# EAGLE design RailroadShield (EAGLE 7.7.0)
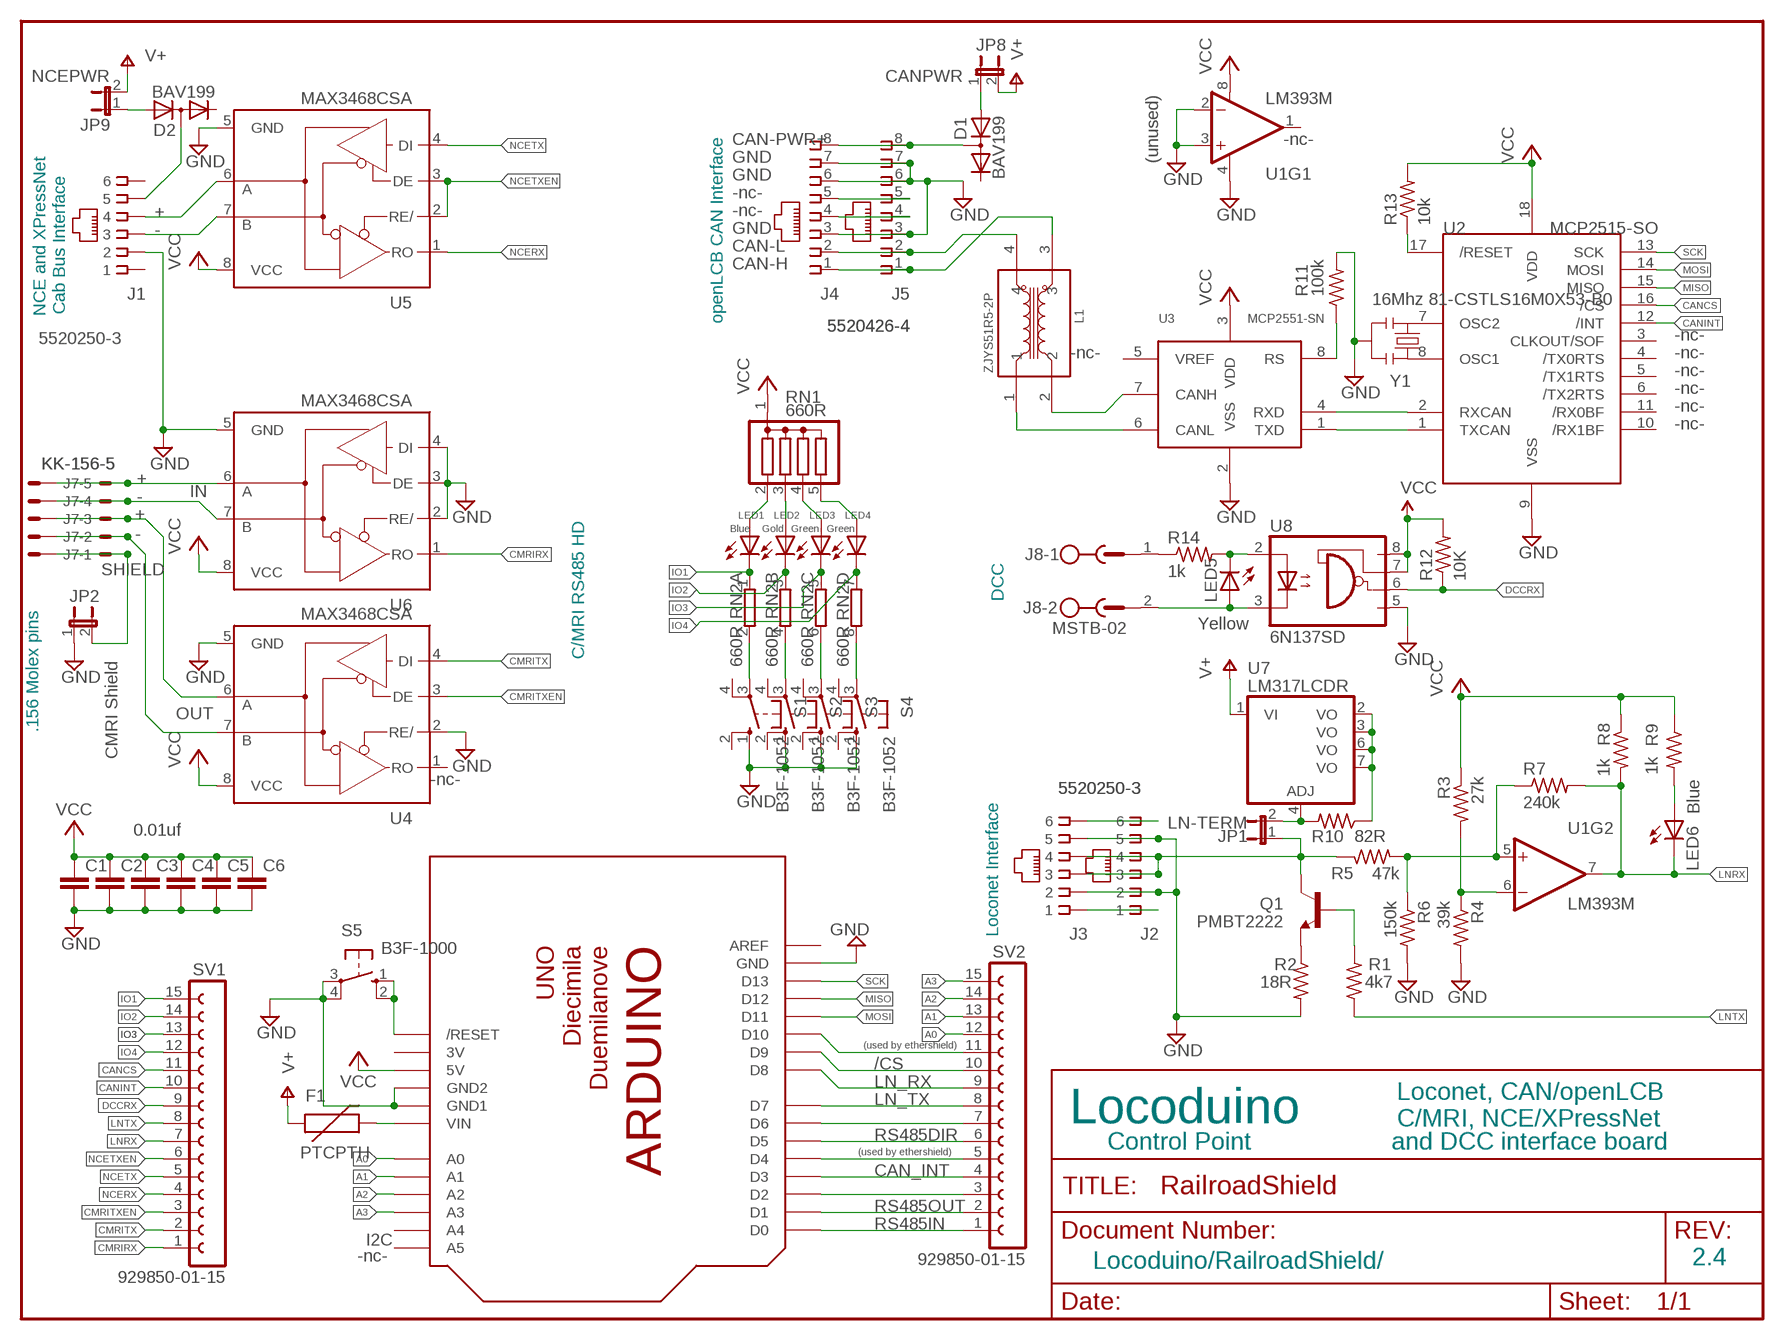
[diagram p0: schematic, sheet 1]

## Parts
C1  0.01uf  CAP0805  [0805]
C2  0.01uf  CAP0805  [0805]
C3  0.01uf  CAP0805  [0805]
C4  0.01uf  CAP0805  [0805]
C5  0.01uf  CAP0805  [0805]
C6  0.01uf  CAP0805  [0805]
D1  BAV199  [SOT23]
D2  BAV199  [SOT23]
F1  PTCPTH  [PTC]
J1  5520250-3  RJ11-6XRA  [RJ11-NO_SHIELD]
J2  5520250-3  RJ11-6XRA  [RJ11-NO_SHIELD]
J3  5520250-3  RJ11-6XRA  [RJ11-NO_SHIELD]
J4  5520426-4  RJ45-8X  [RJ45-NO-SHIELD]
J5  5520426-4  RJ45-8X  [RJ45-NO-SHIELD]
J6  KK-156-5  [KK-156-5]
J7  KK-156-5  [KK-156-5]
J8  MSTB-02  MSTBV2  [MSTBV2]
JP1  LN-TERM  JUMPER-2PTH_LOCK  [1X02_LOCK]
JP2  CMRI Shield  JUMPER-2PTH_LOCK  [1X02_LOCK]
JP8  CANPWR  JUMPER-2PTH_LOCK  [1X02_LOCK]
JP9  NCEPWR  JUMPER-2PTH_LOCK  [1X02_LOCK]
L1  ZJYS51R5-2P  [ZJYS]
LED1  Blue  LEDCHIP-LED0805  [CHIP-LED0805]
LED2  Gold  LEDCHIP-LED0805  [CHIP-LED0805]
LED3  Green  LEDCHIP-LED0805  [CHIP-LED0805]
LED4  Green  LEDCHIP-LED0805  [CHIP-LED0805]
LED5  Yellow  LEDCHIP-LED0805  [CHIP-LED0805]
LED6  Blue  LEDCHIP-LED0805  [CHIP-LED0805]
Q1  PMBT2222  TRANSISTOR_NPNSOT23-3  [SOT23-3]
R1  4k7  R-US_R0805  [R0805]
R2  18R  R-US_R0805  [R0805]
R3  27k  R-US_R0805  [R0805]
R4  39k  R-US_R0805  [R0805]
R5  47k  R-US_R0805  [R0805]
R6  150k  R-US_R0805  [R0805]
R7  240k  R-US_R0805  [R0805]
R8  1k  R-US_R0805  [R0805]
R9  1k  R-US_R0805  [R0805]
R10  82R  R-US_R0805  [R0805]
R11  100k  R-US_R0805  [R0805]
R12  10K  R-US_R0805  [R0805]
R13  10k  R-US_R0805  [R0805]
R14  1k  R-US_R0805  [R0805]
RN1  660R  G04R  [SIL5]
RN2  660R  E4R  [SIL8]
S1  B3F-1052  10-XX  [B3F-10XX]
S2  B3F-1052  10-XX  [B3F-10XX]
S3  B3F-1052  10-XX  [B3F-10XX]
S4  B3F-1052  10-XX  [B3F-10XX]
S5  B3F-1000  10-XX  [B3F-10XX]
SV1  929850-01-15  FE15-1  [FE15]
SV2  929850-01-15  FE15-1  [FE15]
U1  LM393M  [SO08]
U2  MCP2515-SO  [SO-18W]
U3  MCP2551-SN  [SO-08]
U4  MAX3468CSA  [SO08]
U5  MAX3468CSA  [SO08]
U6  MAX3468CSA  [SO08]
U7  LM317LCDR  LM317LD  [SO08]
U8  6N137SD  6N137S  [SM8]
U$1  ARDUINODUEMILANOVE  [ARDUINO-BIGSHIELD]
Y1  16Mhz 81-CSTLS16M0X53-B0  RESONATORPTH  [RESONATOR-PTH]

## Nets
/RESET: R13.1 U2.17(/RESET)
A0: SV2.12 U$1.A0
A1: SV2.13 U$1.A1
A2: SV2.14 U$1.A2
A3: SV2.15 U$1.A3
A/RESET: S5.1(S) S5.2(S1) U$1.RESET(/RESET)
CAN-H [Power]: J4.1 J5.1 L1.3
CAN-L [Power]: J4.2 J5.2 L1.4
CAN-PWR+ [Power]: D1.3(AC) J4.8 J5.8
CANCS: SV1.11 U2.16(/CS)
CANH [Power]: L1.2 U3.7(CANH)
CANINT: SV1.10 U2.12(/INT)
CANL [Power]: L1.1 U3.6(CANL)
CMRIRX: SV1.1 U6.1(RO)
CMRITX: SV1.2 U4.4(DI)
CMRITXEN: SV1.3 U4.3(DE)
D0: SV2.1 U$1.D0
D1: SV2.2 U$1.D1
D2: SV2.3 U$1.D2
D3: SV2.4 U$1.D3
D4: SV2.5 U$1.D4
D5: SV2.6 U$1.D5
D6: SV2.7 U$1.D6
D7: SV2.8 U$1.D7
D8: SV2.9 U$1.D8
D9: SV2.10 U$1.D9
D10: SV2.11 U$1.D10
DCC-A [Power]: LED5.C R14.2 U8.2(A)
DCCB [Power]: J8.2 LED5.A U8.3(C)
DCCRX: R12.1 SV1.9 U8.6(VO)
GND [Power]: C1.2 C2.2 C3.2 C4.2 C5.2 C6.2 J1.2 J2.2 J2.5 J3.2 J3.5 J4.3 J4.6 J4.7 J5.3 J5.6 J5.7 JP2.1 R2.2 R4.2 R6.2 R11.2 S1.1(S) S2.1(S) S3.1(S) S4.1(S) S5.3(P) S5.4(P1) U1.2(-IN) U1.3(+IN) U1.4(V-) U2.9(VSS) U3.2(VSS) U4.2(RE/) U4.5(GND) U5.5(GND) U6.2(RE/) U6.3(DE) U6.4(DI) U6.5(GND) U8.5(GND) U$1.GND U$1.GND1 U$1.GND2 Y1.2
IO1: LED1.C RN2.1 SV1.15
IO2: LED2.C RN2.3 SV1.14
IO3: LED3.C RN2.5 SV1.13
IO4: LED4.C RN2.7 SV1.12
L6+: LED6.A R9.2
LN-TX [Power]: Q1.1(B) R1.2
LNRX: LED6.C R7.2 R8.2 SV1.7 U1.7(OUT)
LNTX: R1.1 SV1.8
LOCONET [Power]: J2.3 J2.4 J3.3 J3.4 JP1.1 Q1.3(C) R5.1
LOCONET-IN: R5.2 R6.1 R7.1 U1.5(+IN)
MISO: U2.15(MISO) U$1.D12
MOSI: U2.14(MOSI) U$1.D11
N$1 [Power]: Q1.2(E) R2.1
N$2: LED1.A RN1.2
N$3: LED2.A RN1.3
N$4: LED3.A RN1.4
N$5: LED4.A RN1.5
N$6 [Power]: J6.1 J7.1 JP2.2
N$7: J6.2 J7.2 U4.7(B)
N$8: J6.3 J7.3 U4.6(A)
N$9: J6.4 J7.4 U6.7(B)
N$10: J6.5 J7.5 U6.6(A)
N$11 [Power]: J8.1 R14.1
N$12: U2.8(OSC1) Y1.3
N$13: U2.7(OSC2) Y1.1
N$14 [Power]: D2.1(A) JP9.1
N$15 [Power]: D1.1(A) JP8.1
N$16: RN2.2 S1.3(P)
N$17: RN2.4 S2.3(P)
N$18: RN2.6 S3.3(P)
N$19: RN2.8 S4.3(P)
N$20 [Power]: JP1.2 R10.2 U7.4(ADJ)
N$21 [Power]: F1.P$2 U$1.VIN
N-A: J1.4 U5.6(A)
N-B: J1.3 U5.7(B)
NCE-PWR+ [Power]: D2.3(AC) J1.5
NCERX: SV1.4 U5.1(RO)
NCETX: SV1.5 U5.4(DI)
NCETXEN: SV1.6 U5.2(RE/) U5.3(DE)
O-RESA [Power]: J4.4 J5.4
O-RESB [Power]: J4.5 J5.5
RAILSYNCA [Power]: J2.6 J3.6
RAILSYNCB [Power]: J2.1 J3.1
RS: R11.1 U3.8(RS)
RXCAN: U2.2(RXCAN) U3.4(RXD)
SCK: U2.13(SCK) U$1.D13
TXCAN: U2.1(TXCAN) U3.1(TXD)
V+ [Power]: F1.P$1 JP8.2 JP9.2 U7.1(VI)
V-LNREF: R3.2 R4.1 U1.6(-IN)
VCC [Power]: C1.1 C2.1 C3.1 C4.1 C5.1 C6.1 R3.1 R8.1 R9.1 R12.2 R13.2 RN1.1 U1.8(V+) U2.18(VDD) U3.3(VDD) U4.8(VCC) U5.8(VCC) U6.8(VCC) U8.7(VE) U8.8(VCC) U$1.5V
VOUT [Power]: R10.1 U7.2(VO) U7.3(VO) U7.6(VO) U7.7(VO)
Unconnected: D1.2(C) D2.2(C) J1.1 J1.6 S1.2(S1) S1.4(P1) S2.2(S1) S2.4(P1) S3.2(S1) S3.4(P1) S4.2(S1) S4.4(P1) U1.1(OUT) U2.3(CLKOUT/SOF) U2.4(/TX0RTS) U2.5(/TX1RTS) U2.6(/TX2RTS) U2.10(/RX1BF) U2.11(/RX0BF) U3.5(VREF) U4.1(RO) U$1.A4 U$1.A5 U$1.AREF

## Notes on the sheet
- -nc-
- (unused)
- -nc-
- + | -nc-
- -
- NCE and XPressNet | Cab Bus Interface
- openLCB CAN Interface
- -nc-
- -nc- | -nc-
- -nc-
- -nc-
- -nc-
- -nc-
- +
- IN
- -
- +
- -
- DCC
- SHIELD
- C/MRI RS485 HD
- OUT
- .156 Molex pins
- -nc-
- Loconet Interface
- (used by ethershield)
- /CS
- LN_RX
- Loconet, CAN/openLCB
- LN_TX
- Locoduino | C/MRI, NCE/XPressNet
- RS485DIR
- Control Point | and DCC interface board
- (used by ethershield)
- CAN_INT
- RS485OUT
- I2C | RS485IN
- -nc- | 2.4
- Locoduino/RailroadShield/

## Power pins joined to a net without a drawn wire
3V: U$1.3V

## Library data of the parts
C1-C6 = MCP:CAP: Capacitor Standard 0603 ceramic capacitor, and 0.1" leaded capacitor.
D1 D2 = diode:BAV199: DIODE low-leakage double diode
F1 = SparkFun:PTC: Resettable Fuse PTC Resettable Fuse. Spark Fun Electronics SKU : COM-08357
J1-J3 = MCP:RJ11: CORCOM Modular RJ Jacks No Shield Source: www.tycoelectronics.com .. ENG_DS_1654001_1099_RJ_L_0507.pdf
J4 J5 = MCP:RJ45: CORCOM Modular RJ Jacks No Shield Source: www.tycoelectronics.com .. ENG_DS_1654001_1099_RJ_L_0507.pdf
J6 J7 = MCP:KK-156-5: KK 156 HEADER Source: http://www.molex.com/pdm_docs/sd/026604100_sd.pdf
J8 = MCP:MSTBV2: PHOENIX
JP1 JP2 JP8 JP9 = MCP:JUMPER-2: Jumper Basic 0.1" spaced jumper. Use with breakaway headers.
L1 = MCP:ZJYS51R5: TDK ZJYS51R5-2P Common Mode Filter
LED1-LED6 = MCP:LED: LED OSRAM: - CHIPLED LG R971, LG N971, LY N971, LG Q971, LY Q971, LO R971, LY R971 LH N974, LH R974 LS Q976, LO Q976, LY Q976 LO Q996 - Hyper CHIPLED LW Q18S LB Q993, LB Q99A, LB R99A - SideLED LS A670, LO A670, LY A670, LG A670, LP A670 LB A673, LV A673, LT A673, LW A673 LH A674 LY A675 LS A676, LA A676, LO A676, LY A676, LW A676 LS A679, LY A679, LG A679 - Hyper Micro SIDELED® LS Y876, LA Y876, LO Y876, LY Y876 LT Y87S - SmartLED LW L88C, LW L88S LB L89C, LB L89S, LG L890 LS L89K, LO L89K, LY L89K LS L896, LA L896, LO L896, LY L896 - TOPLED LS T670, LO T670, LY T670, LG T670, LP T670 LSG T670, LSP T670, LSY T670, LOP T670, LYG T670 LG T671, LOG T671, LSG T671 LB T673, LV T673, LT T673, LW T673 LH T674 LS T676, LA T676, LO T676, LY T676, LB T676, LH T676, LSB T676, LW T676 LB T67C, LV T67C, LT T67C, LS T67K, LO T67K, LY T67K, LW E67C LS E67B, LA E67B, LO E67B, LY E67B, LB E67C, LV E67C, LT E67C LW T67C LS T679, LY T679, LG T679 LS T770, LO T770, LY T770, LG T770, LP T770 LB T773, LV T773, LT T773, LW T773 LH T774 LS E675, LA E675, LY E675, LS T675 LS T776, LA T776, LO T776, LY T776, LB T776 LHGB T686 LT T68C, LB T68C - Hyper Mini TOPLED® LB M676 - Mini TOPLED Santana® LG M470 LS M47K, LO M47K, LY M47K Source: http://www.osram.convergy.de LUXEON: - LUMILED® LXK2-PW12-R00, LXK2-PW12-S00, LXK2-PW14-U00, LXK2-PW14-V00 LXK2-PM12-R00, LXK2-PM12-S00, LXK2-PM14-U00 LXK2-PE12-Q00, LXK2-PE12-R00, LXK2-PE12-S00, LXK2-PE14-T00, LXK2-PE14-U00 LXK2-PB12-K00, LXK2-PB12-L00, LXK2-PB12-M00, LXK2-PB14-N00, LXK2-PB14-P00, LXK2-PB14-Q00 LXK2-PR12-L00, LXK2-PR12-M00, LXK2-PR14-Q00, LXK2-PR14-R00 LXK2-PD12-Q00, LXK2-PD12-R00, LXK2-PD12-S00 LXK2-PH12-R00, LXK2-PH12-S00 LXK2-PL12-P00, LXK2-PL12-Q00, LXK2-PL12-R00 Source: www.luxeon.com KINGBRIGHT: KA-3528ASYC Source: www.kingbright.com
Q1 = MCP:TRANSISTOR_NPN: Transistor NPN BJT configuration in SOT23 package. MMBT2222 is the common NPN we use. Double check BCE configuration again layout.
R1-R14 = rcl:R-US_: RESISTOR, American symbol
RN1 = resistor-sil:G04R: SIL RESISTOR; OC_FARNELL: unknown; OC_NEWARK: unknown
RN2 = resistor-sil:E4R: SIL RESISTOR; OC_FARNELL: unknown; OC_NEWARK: unknown
S1-S5 = MCP:10-XX: OMRON SWITCH
SV1 SV2 = con-lsta:FE15-1: FEMALE HEADER; OC_FARNELL: unknown; OC_NEWARK: unknown
U1 = MCP:LM393
U2 = MCP:MCP2515: Microchip MCP2515 Stand-Alone CAN Controller With SPI Interface Microchip Technology?s MCP2515 is a stand-alone Controller Area Network (CAN) controller that implements the CAN specification, version 2.0B. It is capable of transmitting and receiving both standard and extended data and remote frames. The MCP2515 has two acceptance masks and six acceptance filters that are used to filter out unwanted messages, thereby reducing the host MCUs overhead. The MCP2515 interfaces with microcontrollers (MCUs) via an industry standard Serial Peripheral Interface (SPI).
U3 = MCP:MCP2551: MCP2551 High-Speed CAN Transceiver
U4-U6 = MCP:MAX34*: +5V, Fail-Safe, 40Mbps, Profibus RS-485/RS-422 Transceivers Source: MAX3465-MAX3469.pdf
U7 = MCP:LM317LD: LOW CURRENT 1.2 TO 37V ADJUSTABLE VOLTAGE REGULATOR Source: http://pdf.alldatasheet.com
U8 = MCP:6N137: High Speed OPTO COUPLER Logic Gate output
U$1 = MCP:ARDUINO: Arduino Diecimila/Duemilanove Make a shield with ease, this package has all the named pins as well as the two mounting drill holes and an outline of the USB and DC power connector. The outline is on the DIMENSION layer, so if your board house uses it they will cut the outline to match. http://www.ladyada.net/library/pcb/eaglelibrary.html
Y1 = MCP:RESONATOR: Resonator Small SMD resonator. This is the itty bitty 10/20MHz resonators with built in caps. CSTCE10M0G55 and CSTCE20M0V53. Footprint has been reviewed closely but hasn't been tested yet.

## Net classes
1 Power: width 0.508 mm, clearance 0.254 mm

## Board
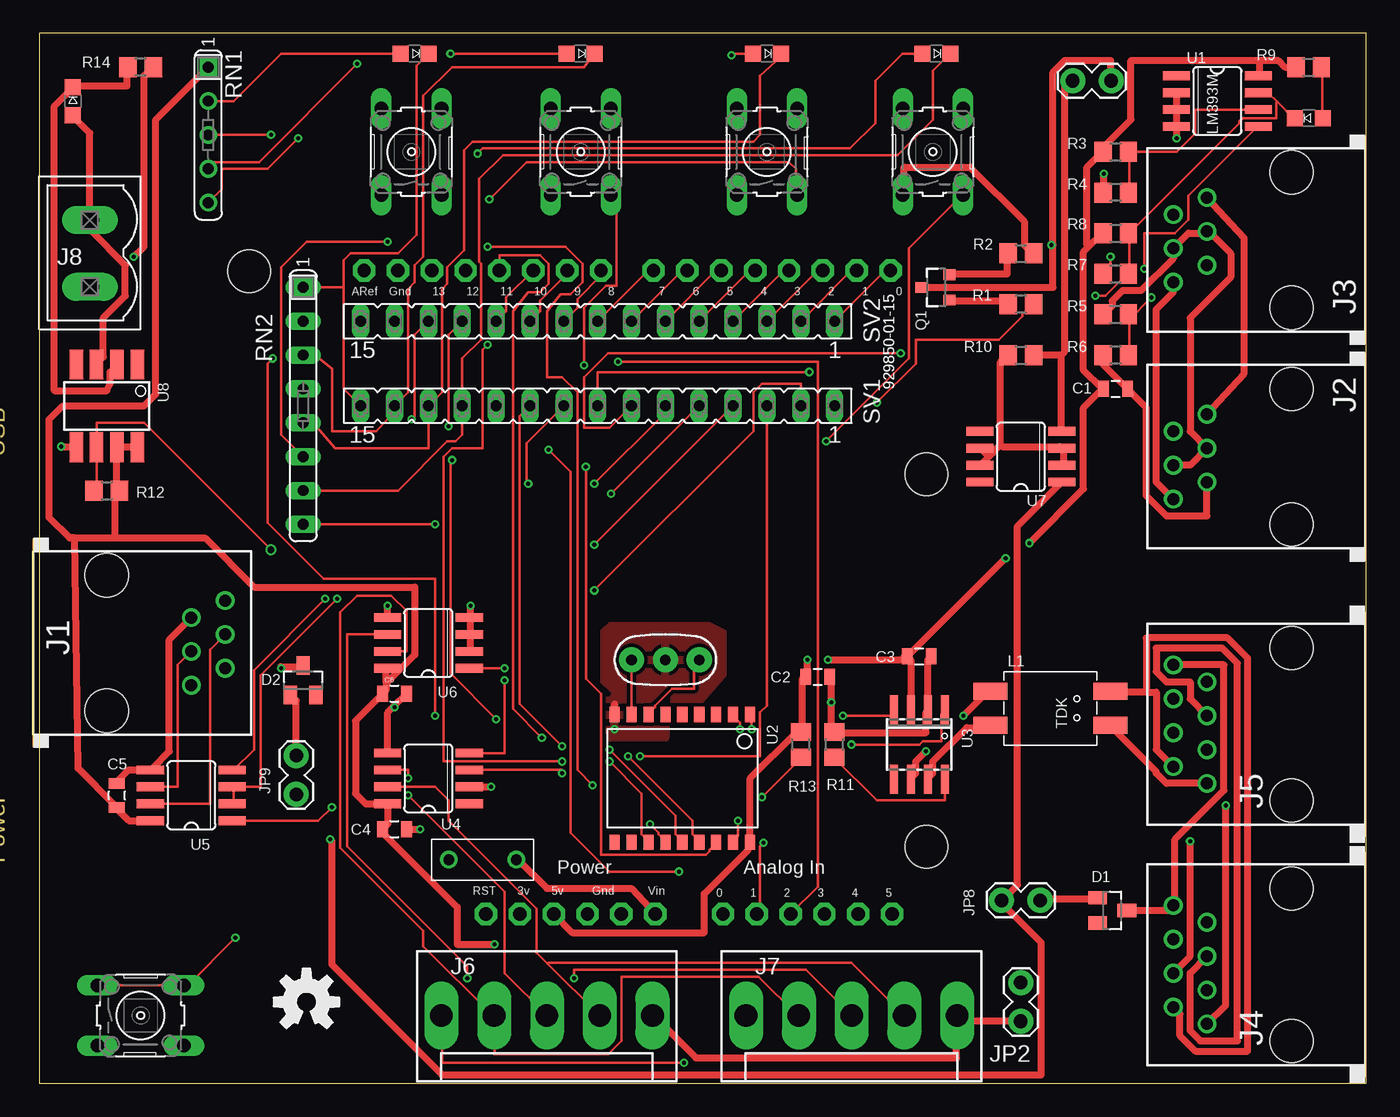
[diagram p1: board, top side]
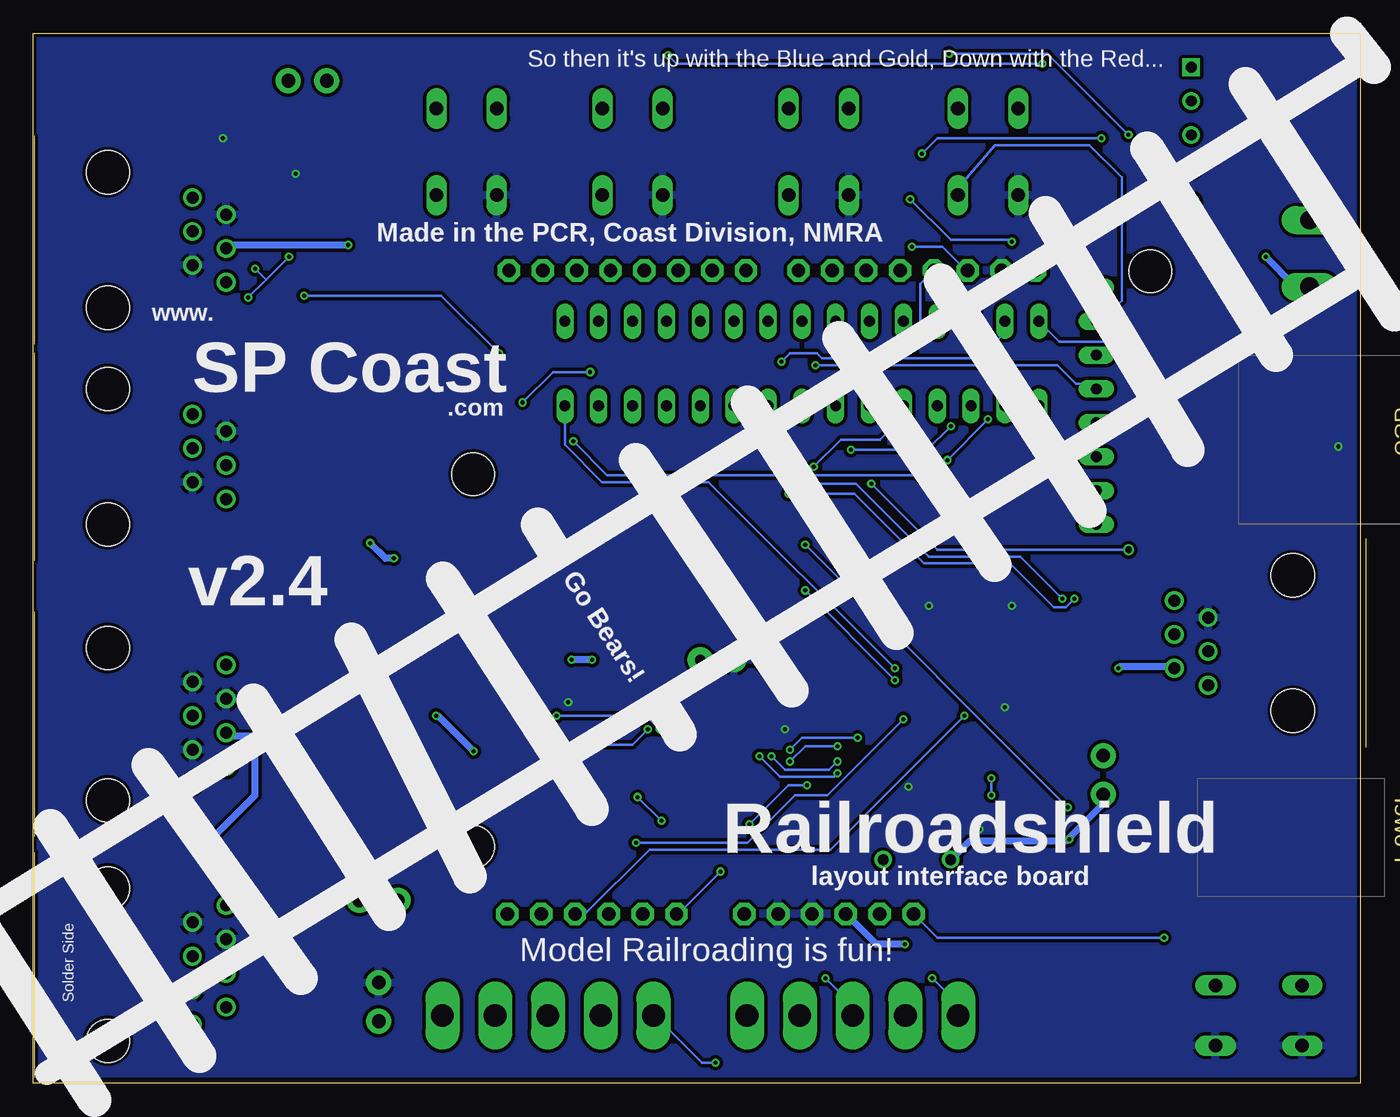
[diagram p2: board, bottom side, seen from below]

Size 100 x 78.74 mm. Coordinates in mm from the lower left corner, seen from the top.
Copper layers (1*16): Top 0.035mm / dielectric 1.5mm / Bottom 0.035mm
Design rules "Fusion_eagle_rule_v1.1 *": minimum track width 8mil, minimum drill 12mil, track to track 8mil, track to pad 8mil, pad to pad 8mil, via to via 8mil, smd to smd 0mil, copper to edge 10mil, drill to drill 10mil, minimum pad ring 10mil, minimum via ring 6mil, stop-mask expansion 2mil, vias tented up to drill 100mil, thermal gap 10mil
tRestrict: 7 lines

### Footprints (pad centres in the part's own frame; a part is rotated, then mirrored left to right if it is on the bottom)
0805 = smd 0.8 x 1.2: 1 -0.9,0; 2 0.9,0
SOT23 = smd 1 x 1.4: 1 -0.95,-1.1; 2 0.95,-1.1; 3 0,1.1
PTC = drill 0.8: P$1 -2.54,0; P$2 2.54,0
RJ11-NO_SHIELD = drill 0.9 pad 1.4: 1 -3.175,8.89; 2 -1.905,6.35; 3 -0.635,8.89; 4 0.635,6.35; 5 1.905,8.89; 6 3.175,6.35 | hole 3.251: -5.08,0; 5.08,0
RJ45-NO-SHIELD = drill 0.9 pad 1.4: 1 -4.445,6.35; 2 -3.175,8.89; 3 -1.905,6.35; 4 -0.635,8.89; 5 0.635,6.35; 6 1.905,8.89; 7 3.175,6.35; 8 4.445,8.89 | hole 3.251: -5.715,0; 5.715,0
KK-156-5 = drill 1.7 pad 2.184 long: 1 -7.92,0; 2 -3.96,0; 3 0,0; 4 3.96,0; 5 7.92,0
MSTBV2 = drill 1.397 long: 1 -2.5,0; 2 2.5,0
1X02_LOCK = drill 1.016 pad 1.88: 1 -0.178,0; 2 2.718,0
ZJYS = smd 2.54 x 1.27: 1 4.32,-1.46; 2 4.32,1.08; 3 -4.68,1.08; 4 -4.68,-1.46
CHIP-LED0805 = smd 1.2 x 1.2: A 0,-1.05; C 0,1.05
SOT23-3 = smd 0.8 x 0.9: 1 -0.95,-1; 2 0.95,-1; 3 0,1.1
R0805 = smd 1.3 x 1.5: 1 -0.95,0; 2 0.95,0
SIL5 = drill 0.813 square: 1 -5.08,0 | drill 0.813: 2 -2.54,0; 3 0,0; 4 2.54,0; 5 5.08,0
SIL8 = drill 0.813 long: 1 -8.89,0; 2 -6.35,0; 3 -3.81,0; 4 -1.27,0; 5 1.27,0; 6 3.81,0; 7 6.35,0; 8 8.89,0
B3F-10XX = drill 1.016 long: 1 -3.251,2.261; 2 3.251,2.261; 3 -3.251,-2.261; 4 3.251,-2.261
FE15 = drill 0.813 long: 1 -17.78,0; 2 -15.24,0; 3 -12.7,0; 4 -10.16,0; 5 -7.62,0; 6 -5.08,0; 7 -2.54,0; 8 0,0; 9 2.54,0; 10 5.08,0; 11 7.62,0; 12 10.16,0; 13 12.7,0; 14 15.24,0; 15 17.78,0
SO08 = smd 0.66 x 2.032: 1 -1.905,-3.073; 2 -0.635,-3.073; 3 0.635,-3.073; 4 1.905,-3.073; 5 1.905,3.073; 6 0.635,3.073; 7 -0.635,3.073; 8 -1.905,3.073
SO-18W = smd 0.762 x 1.143: 1 -5.08,-4.788; 2 -3.81,-4.788; 3 -2.54,-4.788; 4 -1.27,-4.788; 5 0,-4.788; 6 1.27,-4.788; 7 2.54,-4.788; 8 3.81,-4.788; 9 5.08,-4.788; 10 5.08,4.788; 11 3.81,4.788; 12 2.54,4.788; 13 1.27,4.788; 14 0,4.788; 15 -1.27,4.788; 16 -2.54,4.788; 17 -3.81,4.788; 18 -5.08,4.788
SO-08 = smd 0.6 x 2.2: 1 -1.905,-2.6; 2 -0.635,-2.6; 3 0.635,-2.6; 4 1.905,-2.6; 5 1.905,2.6; 6 0.635,2.6; 7 -0.635,2.6; 8 -1.905,2.6
SM8 = smd 1.016 x 2.235: 1 -2.286,-3.099; 2 -0.762,-3.099; 3 0.762,-3.099; 4 2.286,-3.099; 5 2.286,3.099; 6 0.762,3.099; 7 -0.762,3.099; 8 -2.286,3.099
ARDUINO-BIGSHIELD = drill 1 pad 1.676 octagon: 3V 36.068,2.54; 5V 38.608,2.54; A0 51.308,2.54; A1 53.848,2.54; A2 56.388,2.54; A3 58.928,2.54; A4 61.468,2.54; A5 64.008,2.54; AREF 24.384,50.8; D0 63.881,50.8; D1 61.341,50.8; D2 58.801,50.8; D3 56.261,50.8; D4 53.721,50.8; D5 51.181,50.8; D6 48.641,50.8; D7 46.101,50.8; D8 42.164,50.8; D9 39.624,50.8; D10 37.084,50.8; D11 34.544,50.8; D12 32.004,50.8; D13 29.464,50.8; GND 26.924,50.8; GND1 43.688,2.54; GND2 41.148,2.54; RESET 33.528,2.54; VIN 46.228,2.54 | hole 3.2: 15.758,50.754; 66.558,35.514; 66.558,7.574
RESONATOR-PTH = drill 0.8 pad 1.88: 1 -2.54,0; 2 0,0; 3 2.54,0

### Placement (x,y rotation side)
C1  81.2,52.07 0 top
C2  58.85,30.48 0 top
C3  66.47,32 0 top
C4  27.1,19.05 0 top
C5  6.27,21.59 90 top
C6  27.1,29.21 0 top
D1  80.95,12.95 270 top
D2  20.24,30.23 0 top
F1  33.7,16.76 0 top
J1  5.51,33.02 270 top
J2  94.41,46.99 90 top
J3  94.41,63.25 90 top
J4  94.41,8.89 90 top
J5  94.41,26.92 90 top
J6  38.53,5.08 180 top
J7  61.39,5.08 180 top
J8  4.24,62.23 90 top
JP1  80.69,75.18 180 top
JP2  74.09,7.37 270 top
JP8  75.36,13.72 180 top
JP9  19.73,24.38 270 top
L1  76.12,27.94 180 top
LED1  28.62,77.22 270 top
LED2  41.07,77.22 270 top
LED3  55.04,77.22 270 top
LED4  67.74,77.22 270 top
LED5  2.97,73.66 0 top
LED6  95.68,72.39 90 top
Q1  67.74,59.69 90 top
R1  74.09,58.42 180 top
R2  74.09,62.23 0 top
R3  81.2,69.85 0 top
R4  81.2,66.8 180 top
R5  81.2,57.66 0 top
R6  81.2,54.61 180 top
R7  81.2,60.71 0 top
R8  81.2,63.75 0 top
R9  95.68,76.2 0 top
R10  74.09,54.61 0 top
R11  60.12,25.4 90 top
R12  5.51,44.45 0 top
R13  57.58,25.4 90 top
R14  8.05,76.2 180 top
RN1  13.13,71.12 270 top
RN2  20.24,50.8 270 top
S1  28.37,69.85 90 top
S2  41.07,69.85 90 top
S3  55.04,69.85 90 top
S4  67.49,69.85 90 top
S5  8.05,5.08 0 top
SV1  42.34,50.8 180 top
SV2  42.34,57.15 180 top
U1  88.82,73.66 270 top
U2  48.69,22.86 180 top
U3  66.47,25.4 180 top
U4  29.64,22.86 90 top
U5  11.86,21.59 90 top
U6  29.64,33.02 90 top
U7  74.09,46.99 90 top
U8  5.51,50.8 180 top
U$1  0.43,10.16 0 top
U$2  OSHW-LOGOM  [OSHW-LOGO-M]  20.5,6.1 0 top
Y1  47.42,31.75 180 top

### Tracks (layer width: path | path; a pad name or v marks a point on that pad's centre or on a via)
/RESET  (via drill 0.3)
  Top 0.203: v52.88,19.68 52.88,18.54 52.5,18.16 U2.17 | v54.66,21.46 57.58,24.38 R13.1
  Bottom 0.203: v52.88,19.68 v54.66,21.46
A0  (via drill 0.3)
  Top 0.203: SV2.12 31.16,56.13 v31.16,49.28 | v38.66,47.5 40.31,45.85 40.31,18.8 43.23,15.88 v48.44,15.88
  Bottom 0.203: v31.16,49.28 32.94,47.5 v38.66,47.5 | v48.44,15.88 51.61,12.7 U$1.A0
A1  (via drill 0.3)
  Top 0.203: SV2.13 28.62,56.13 28.62,50.04 v28.37,49.78 | v31.42,46.74 31.29,46.61 31.29,30.73 v34.72,27.3 | v54.79,18.03 54.53,17.78 54.53,12.95 U$1.A1
  Bottom 0.203: v31.42,46.74 v28.37,49.78 | v34.72,27.3 40.44,21.59 42.85,21.59 46.4,18.03 v54.79,18.03
A2  (via drill 0.3)
  Top 0.203: v43.86,54.1 58.85,54.1 58.85,14.73 U$1.A2
  Bottom 0.203: SV2.14 27.1,56.01 27.35,56.01 29,54.36 40.82,54.36 41.2,54.74 43.23,54.74 v43.86,54.1
A3  (via drill 0.3)
  Top 0.203: v17.96,54.36 17.57,53.98 17.57,42.04 21.77,37.85 30.15,37.85 v30.15,27.56
  Bottom 0.203: SV2.15 23.04,55.63 19.23,55.63 v17.96,54.36 | v30.15,27.56 40.18,17.53 53.77,17.53 58.6,12.7 U$1.A3
A/RESET  (via drill 0.3)
  Top 0.203: S5.1 4.88,7.37 11.22,7.37 S5.2 11.35,7.37 11.61,7.37 v15.16,10.92
  Bottom 0.203: U$1.RESET 32.18,10.92 v15.16,10.92
CAN-H  (via drill 0.3)
  Top 0.508: J5.1 85.01,22.48 84.25,23.24 84.25,23.37 80.82,26.8 L1.3 | J4.1 89.46,5.84 v89.46,20.83
  Bottom 0.508: v89.46,20.83 88.06,22.23 J5.1
CAN-L
  Top 0.508: 83.49,29.34 84.25,29.34 84.25,25.02 J5.2 | 83.49,29.34 80.82,29.34 L1.4 | J4.2 86.03,5.21 86.03,3.56 87.17,2.41 91.11,2.41 91.11,31.88 89.58,33.4 83.49,33.4 83.49,29.34
CAN-PWR+
  Top 0.508: D1.3 85.52,12.95 J4.8 85.65,13.46 85.65,18.29 89.33,21.97 89.33,31.37 J5.8
CANCS  (via drill 0.3)
  Top 0.203: v41.45,46.23 41.45,30.35 42.59,29.21 42.59,17.14 50.47,17.14 50.72,17.4 50.72,17.53 51.23,18.03 U2.16
  Bottom 0.203: v41.45,46.23 39.42,48.26 36.5,48.26 34.72,50.04 SV1.11
CANH
  Top 0.508: U3.7 67.1,22.86 67.49,23.24 67.49,24.13 70.03,26.67 71.68,26.67 71.68,26.8 L1.2
CANINT  (via drill 0.3)
  Top 0.203: v43.23,24.13 45.64,21.72 45.64,18.67 46.15,18.16 U2.12 | v39.67,25.27 36.5,28.45 36.5,50.04 SV1.10
  Bottom 0.203: v43.23,24.13 42.09,25.27 v39.67,25.27
CANL  (via drill 0.3)
  Top 0.508: v66.98,24.89 66.22,24.13 66.22,23.24 65.84,22.86 U3.6 | v69.77,27.56 71.68,29.46 L1.1
  Bottom 0.508: v66.98,24.89 69.65,27.56 v69.77,27.56
CMRIRX  (via drill 0.3)
  Top 0.203: U6.1 v35.35,31.11
  Bottom 0.203: v35.35,31.11 49.33,45.09 57.33,45.09 60.12,47.88 SV1.1
CMRITX  (via drill 0.3)
  Top 0.203: v35.35,30.23 35.35,24.77 U4.4 | v42.09,36.96 54.02,48.9 54.02,51.82 54.66,52.45 57.58,52.45 SV1.2
  Bottom 0.203: v35.35,30.23 v42.09,36.96
CMRITXEN  (via drill 0.3)
  Top 0.203: v39.67,23.24 39.67,23.5 U4.3 | v45.52,24.51 54.53,24.51 54.53,27.81 55.04,28.32 SV1.3
  Bottom 0.203: v39.67,23.24 39.93,22.99 43.99,22.99 v45.52,24.51
D0
  Top 0.203: SV2.1 63.93,60.96 U$1.D0
D1
  Top 0.203: SV2.2 61.39,60.96 U$1.D1
D2
  Top 0.203: SV2.3 58.85,60.96 U$1.D2
D3
  Top 0.203: SV2.4 56.31,60.96 U$1.D3
D4
  Top 0.203: SV2.5 53.77,60.96 U$1.D4
D5
  Top 0.203: SV2.6 51.23,60.96 U$1.D5
D6
  Top 0.203: SV2.7 48.69,60.96 U$1.D6
D7
  Top 0.203: SV2.8 46.15,60.96 U$1.D7
D8
  Top 0.203: SV2.9 40.82,58.17 40.82,58.8 42.59,60.58 U$1.D8
D9
  Top 0.203: SV2.10 38.02,57.91 38.02,58.67 40.05,60.71 U$1.D9
D10
  Top 0.203: SV2.11 35.48,57.91 35.48,58.93 U$1.D10
DCC-A
  Top 0.508: R14.2 7.03,76.2 7.03,74.8 2.97,74.8 LED5.C 2.84,74.55 1.57,73.28 1.57,51.94 5.51,51.94 5.76,52.45 5.76,53.34 6.27,53.85 U8.2
DCCB
  Top 0.508: LED5.A 2.97,72.52 4.24,71.25 J8.2 4.37,64.52 4.37,63.88 6.91,61.34 6.91,59.05 5.26,57.4 5.26,54.48 4.75,53.98 U8.3
DCCRX  (via drill 0.3, 0.5 pad 0.61)
  Top 0.203: R12.1 4.62,44.45 4.75,44.58 U8.6 4.75,49.53 8.3,49.53 v17.83,40.01 | SV1.9 37.01,48.01 37.01,45.09 v37.13,44.96
  Bottom 0.203: v37.13,44.96 32.18,40.01 v17.83,40.01
GND  (via drill 0.3, 0.3 pad 0.61)
  Top 0.508: C2.2 59.87,30.48 v59.87,28.57 59.87,26.67 60.12,26.42 R11.2 60.25,26.29 66.98,26.29 66.98,27.81 U3.2 67.1,31.75 C3.2 | 27.04,28.26 26.59,27.81 26.59,24.77 U4.5 | 27.04,28.26 C6.2 | U1.2 85.77,74.3 85.77,73.15 U1.3 85.77,73.03 85.77,71.75 U1.4 85.77,71.63 v85.77,70.87 | U6.2 32.81,32.38 32.81,33.66 U6.3 32.81,33.78 32.81,34.92 U6.4 32.81,35.05 v32.81,35.81 | U2.9 43.61,28.19 43.61,28.44 | C4.2 v29,19.05 | R2.2 74.98,62.23 74.34,62.87 74.34,64.64 70.28,68.71 65.33,68.71 65.33,66.67 S4.1 | v80.31,68.2 80.31,66.8 R4.2 | U4.2 v34.34,22.23 | v26.59,35.81 26.59,34.92 U6.5 | v2.08,47.75 3.22,47.75 U8.5 | 27.04,28.26 v27.1,28.19 | S5.3 4.75,2.92 | C5.2 6.27,22.61 7.16,23.5 U5.5 8.94,23.62 10.21,24.89 10.21,33.27 J1.2 | R6.2 80.31,54.61 80.31,53.85 C1.2 82.22,51.94 83.49,50.67 83.49,44.07 85.01,42.55 88.06,42.55 J2.2
  other vias: 43.61,26.54
  pour Bottom (isolate 0.254): 0.94,10.67 0.94,78.49 99.74,78.23 99.49,0.76 0.94,0.76
  pour Top: 47.42,25.91 43.36,25.91 42.59,29.97 42.59,34.04 43.36,34.8 51.48,34.8 52.25,34.04 52.25,28.7 48.44,28.7 47.42,27.69
IO1
  Top 0.203: 23.29,59.69 RN2.1 | LED1.C 29.64,77.22 28.75,76.33 28.75,63.63 27.35,62.23 23.8,62.23 23.29,61.72 23.29,59.69 | 23.29,59.69 23.29,52.07 SV1.15
IO2
  Top 0.203: LED2.C 42.09,77.22 41.32,76.2 31.42,76.2 29.26,74.04 29.26,61.98 28.62,61.34 28.62,60.07 28.12,59.56 28.12,51.82 SV1.14 26.59,50.29 26.59,49.78 25.7,48.9 22.4,48.9 22.4,53.59 21.13,54.61 RN2.3
IO3
  Top 0.203: LED3.C 56.06,76.96 54.53,75.56 54.53,71.12 54.02,70.61 32.94,70.61 32.31,69.98 32.31,62.48 31.04,61.21 31.04,59.94 30.66,59.56 30.66,51.82 SV1.13 29.64,47.62 22.66,47.62 21,49.53 RN2.5
IO4
  Top 0.203: RN2.7 27.35,44.45 31.04,48.13 31.67,48.13 32.18,48.64 SV1.12 32.18,54.36 33.58,55.75 33.58,61.47 33.45,61.59 33.45,67.82 35.23,69.6 64.82,69.6 67.49,72.26 67.49,75.95 68.76,77.22 LED4.C
L6+
  Top 0.203: LED6.A 96.7,72.39 96.7,76.2 R9.2
LN-TX
  Top 0.508: Q1.1 68.76,58.67 73.07,58.67 73.07,58.42 R1.2
LNRX  (via drill 0.3)
  Top 0.203: 82.22,63.75 82.22,60.71 R7.2 82.09,60.71 80.44,59.05 v79.68,59.05 | 93.33,73.6 92.63,74.3 U1.7 | 93.33,73.6 94.54,72.39 LED6.C | 82.22,63.75 90.47,72.01 90.47,72.14 90.73,72.39 93.27,72.39 93.27,73.53 93.33,73.6 | 82.22,63.75 R8.2 | SV1.7 43.23,49.15 41.32,49.15 41.32,52.96 43.1,54.74 v65.07,54.74
  Bottom 0.203: v65.07,54.74 69.39,59.05 v79.68,59.05
LNTX  (via drill 0.3)
  Top 0.203: v63.3,51.05 66.22,53.98 66.22,55.75 72.44,55.75 74.22,57.53 74.22,57.66 74.98,58.42 R1.1 | v58.21,53.34 42.34,53.34 SV1.8
  Bottom 0.203: v63.3,51.05 61.01,53.34 v58.21,53.34
LOCONET  (via drill 0.3)
  Top 0.508: J2.3 86.79,46.35 J2.4 86.79,48.9 86.79,57.4 89.84,60.45 89.84,62.23 88.19,63.88 J3.4 87.93,63.75 86.66,63.75 J3.3 85.52,61.85 83.11,59.44 81.71,59.44 80.95,58.67 80.95,58.29 80.31,57.66 R5.1 | 76.5,62.87 76.5,75.82 77.39,76.71 80.82,76.71 80.82,75.18 JP1.1 | 76.5,62.87 76.5,59.69 Q1.3 | 76.5,62.87 v76.38,62.87
  Bottom 0.508: J3.3 85.27,62.87 v76.38,62.87
LOCONET-IN  (via drill 0.3)
  Top 0.203: 82.22,57.28 82.22,57.66 R5.2 82.22,57.28 | 82.22,57.28 82.22,54.61 R6.1 | v80.82,61.98 80.82,61.21 80.31,60.71 R7.1 | 82.22,57.28 v83.87,58.93 | v83.36,61.09 83.36,63.75 85.65,63.75 86.66,64.77 86.66,66.55 91.87,71.75 U1.5
  Bottom 0.203: v83.87,58.93 82.54,60.26 | 82.54,60.26 v80.82,61.98 | 82.54,60.26 v83.36,61.09
MISO  (via drill 0.3)
  Top 0.203: v44.63,24.51 49.45,19.68 49.45,18.67 49.96,18.16 U2.15 | v39.67,24.13 30.78,24.13 30.78,46.99 31.42,47.62 33.7,47.62 33.7,54.99 v34.09,55.37
  Bottom 0.203: v44.63,24.51 43.61,23.5 40.31,23.5 v39.67,24.13 | v34.09,55.37 33.45,56.13 33.45,59.94 U$1.D12
MOSI  (via drill 0.3)
  Top 0.203: v43.23,25.02 48.18,20.07 48.18,18.67 48.69,18.16 U2.14 | v38.15,25.91 35.99,28.07 35.99,57.91 37.13,59.31 38.02,59.31 38.66,59.94 38.66,61.47 38.02,62.1 34.97,62.1 U$1.D11
  Bottom 0.203: v43.23,25.02 42.34,25.91 v38.15,25.91
N$1
  Top 0.508: Q1.2 68.76,60.71 73.07,60.71 73.07,62.23 R2.1
N$2
  Top 0.203: RN1.2 15.04,73.66 18.59,77.22 LED1.A
N$3  (via drill 0.3)
  Top 0.203: RN1.3 v17.83,71.12 | v31.29,77.22 LED2.A
  Bottom 0.203: v31.29,77.22 23.93,77.22 v17.83,71.12
N$4  (via drill 0.3)
  Top 0.203: LED3.A 52.37,77.22 v52.37,77.09 | v24.31,76.45 16.94,69.09 13.13,69.09 RN1.4
  Bottom 0.203: v24.31,76.45 51.74,76.45 v52.37,77.09
N$5  (via drill 0.3)
  Top 0.203: v33.32,69.72 33.7,70.1 61.26,70.1 63.17,72.01 63.17,75.18 65.2,77.22 LED4.A 66.72,77.22 | v19.86,70.87 17.57,68.58 14.15,68.58 14.15,67.06 RN1.5
  Bottom 0.203: v19.86,70.87 32.18,70.87 v33.32,69.72
N$6
  Top 0.508: JP2.2 74.09,4.7 69.39,4.7 69.39,5.08 J7.1 69.26,4.57 69.26,1.91 49.71,1.91 46.53,5.08 J6.1
N$7
  Top 0.203: U4.7 30.15,22.23 31.16,21.21 31.16,19.68 37.77,13.08 37.77,9.78 38.59,8.95 | 38.59,8.95 42.47,5.08 J6.2 | J7.2 65.33,5.08 61.39,9.02 38.66,9.02 38.59,8.95
N$8  (via drill 0.3)
  Top 0.203: 25.7,23.5 U4.6 28.12,23.5 v28.12,22.86 | v28.12,21.59 35.35,14.35 35.35,8.26 J6.3 | J7.3 57.96,8.51 40.56,8.51 v40.56,7.87
  Bottom 0.203: v28.12,21.59 v28.12,22.86 | v40.56,7.87 38.53,5.84 J6.3
N$9
  Top 0.203: U6.7 27.99,32.38 27.99,35.43 26.85,36.58 24.31,36.58 23.04,35.31 23.04,17.65 29.26,11.43 29.26,10.29 34.47,5.08 J6.4 34.59,5.08 34.59,2.16 43.1,2.16 44.12,3.17 44.12,8 54.41,8 57.33,5.08 J7.4
N$10  (via drill 0.3)
  Top 0.203: v32.56,7.87 32.56,8.76 23.54,17.78 23.54,33.66 U6.6 | v48.82,1.52 30.66,1.52 30.66,5.08 J6.5
  Bottom 0.203: v32.56,7.87 30.66,5.97 30.66,5.08 J6.5 | v48.82,1.52 49.83,1.52 53.39,5.08 J7.5
N$11  (via drill 0.3)
  Top 0.508: v7.54,61.98 8.3,62.74 8.3,75.56 8.94,76.2 R14.1
  Bottom 0.508: v7.54,61.98 5.38,59.82 4.24,59.82 J8.1
N$12
  Top 0.203: U2.8 Y1.3
N$13
  Top 0.203: Y1.1 49.96,31.24 49.58,30.86 49.58,29.59 47.93,29.59 46.66,28.32 46.66,28.19 46.15,27.69 U2.7
N$14
  Top 0.508: D2.1 19.35,29.08 19.73,28.7 JP9.1
N$15
  Top 0.508: D1.1 79.81,13.84 75.61,13.84 75.61,13.72 JP8.1
N$16
  Bottom 0.203: RN2.2 19.86,57.15 18.34,58.67 18.34,67.94 20.75,70.36 27.86,70.36 30.45,67.36 S1.3 30.53,66.55
N$17  (via drill 0.3)
  Top 0.203: v41.32,53.85 41.32,58.17 42.98,59.82 43.74,59.82 43.74,66.17 43.36,66.55 S2.3
  Bottom 0.203: RN2.4 20.62,52.45 21.77,52.45 23.16,53.85 v41.32,53.85
N$18  (via drill 0.3)
  Top 0.203: RN2.6 18.59,48.64 18.59,61.21 20.5,63.12 v26.59,63.12 | v34.21,66.29 37.01,69.09 56.69,69.09 57.2,68.58 57.2,66.67 S3.3
  Bottom 0.203: v26.59,63.12 26.72,63.25 31.16,63.25 v34.21,66.29
N$19  (via drill 0.3)
  Top 0.203: RN2.8 v30.15,41.91 | v59.48,48.13 65.71,54.36 65.71,62.61 69.65,66.55 S4.3
  Bottom 0.203: v30.15,41.91 33.83,45.59 56.95,45.59 v59.48,48.13
N$20
  Top 0.508: 77.14,54.61 77.14,48.9 U7.4 | 77.14,54.61 R10.2 | JP1.2 77.9,75.18 77.39,74.68 77.39,54.86 77.14,54.61
N$21
  Top 0.508: F1.P$2 36.37,16.76 38.53,14.61 44.88,14.61 U$1.VIN
N-A
  Top 0.203: J1.4 10.84,31.37 10.84,22.23 U5.6
N-B
  Top 0.203: J1.3 13.26,32.51 13.26,20.95 U5.7
NCE-PWR+  (via drill 0.3)
  Top 0.508: v18.59,31.11 18.59,31.24 20.24,31.24 D2.3
  Bottom 0.508: v18.59,31.11 18.46,31.24 14.53,31.24 J1.5
NCERX  (via drill 0.3)
  Top 0.203: v22.4,20.7 21.38,19.68 U5.1 | v42.09,40.39 SV1.4
  Bottom 0.203: v22.4,20.7 v42.09,40.39
NCETX  (via drill 0.3)
  Top 0.203: v21.89,36.32 16.56,30.99 16.56,25.02 15.04,23.5 U5.4 | v43.36,44.2 SV1.5
  Bottom 0.203: v21.89,36.32 22.53,35.69 23.42,35.69 26.72,38.99 33.2,38.99 38.4,44.2 v43.36,44.2
NCETXEN  (via drill 0.3)
  Top 0.203: 15.04,22.23 15.04,20.95 U5.2 | 15.04,22.23 17.07,22.23 17.07,30.61 v22.78,36.32 | v42.09,44.96 47.42,50.29 SV1.6 | U5.3 15.04,22.23
  Bottom 0.203: v22.78,36.32 25.96,39.5 32.81,39.5 38.28,44.96 v42.09,44.96
O-RESA  (via drill 0.3)
  Top 0.508: J4.4 86.79,9.53 v86.79,18.16
  Bottom 0.508: v86.79,18.16 83.36,21.59 83.36,26.04 85.27,26.04 J5.4
O-RESB
  Top 0.508: J4.5 86.79,8.26 86.79,3.94 87.55,3.17 90.35,3.17 90.35,31.5 89.2,32.64 84.25,32.64 84.25,30.86 85.01,30.1 86.79,30.1 86.79,28.83 J5.5
RAILSYNCA
  Top 0.508: J2.6 90.85,53.21 90.85,63.37 J3.6
RAILSYNCB
  Top 0.508: J2.1 84.25,45.09 84.25,58.04 85.52,59.31 J3.1
RS
  Top 0.203: R11.1 60.12,24.38 63.3,21.21 68.38,21.21 U3.8
RXCAN  (via drill 0.3)
  Top 0.203: v53.01,26.54 53.01,27.05 52.5,27.56 U2.2 | v60.76,27.56 64.56,27.56 U3.4
  Bottom 0.203: v53.01,26.54 54.02,27.56 v60.76,27.56
SCK  (via drill 0.3)
  Top 0.203: v46.28,19.43 46.91,18.8 46.91,18.67 47.42,18.16 U2.13 | v41.96,22.35 40.82,23.5 40.82,51.82 39.67,52.96 38.53,52.96 38.53,57.91 39.55,59.18 40.31,59.18 41.2,60.07 41.2,61.47 39.93,62.74 v34.09,62.74
  Bottom 0.203: v46.28,19.43 43.36,22.35 v41.96,22.35 | v34.09,62.74 31.8,62.74 30.02,60.96 U$1.D13
TXCAN  (via drill 0.3)
  Top 0.203: v53.9,26.54 53.9,27.43 53.77,27.56 U2.1 | v61.39,25.4 66.47,25.4 66.72,25.65 68.12,25.65 68.12,27.69 68.38,27.94 U3.1
  Bottom 0.203: v53.9,26.54 55.04,25.4 v61.39,25.4
V+  (via drill 0.3)
  Top 0.508: U7.1 77.14,45.09 73.84,41.78 73.84,14.86 72.82,13.84 JP8.2 72.69,13.46 75.61,10.54 75.61,0.64 30.66,0.64 22.4,8.89 22.4,18.16 v22.27,18.29
  Bottom 0.508: 19.73,21.59 JP9.2 19.73,20.95 22.34,18.35 | F1.P$1 29.77,18.16 22.53,18.16 22.34,18.35 | v22.27,18.29 22.34,18.35
V-LNREF
  Top 0.203: 82.22,69.85 82.22,66.8 R4.1 | 82.22,69.85 85.77,69.85 87.17,71.25 87.17,73.03 U1.6 | 82.22,69.85 R3.2
VCC  (via drill 0.3)
  Top 0.508: 26.46,19.3 C4.1 | 26.46,30.1 26.46,29.46 C6.1 26.08,29.08 24.18,27.18 24.18,21.72 24.94,20.95 U4.8 26.59,20.95 26.59,19.43 C4.1 | 26.46,30.1 26.46,31.11 U6.8 | R12.2 6.4,44.45 6.27,44.58 U8.7 6.4,47.75 7.8,47.75 U8.8 7.92,47.88 | RN1.1 9.19,72.26 9.19,51.69 8.3,50.8 2.21,50.8 1.19,49.78 1.19,42.42 2.72,40.89 3.1,40.89 | 6.27,43.94 6.27,44.32 R12.2 | C3.1 65.84,31.75 U3.3 | v58.09,31.75 58.09,30.61 C2.1 57.83,30.48 57.71,30.35 57.71,26.54 R13.2 57.58,26.29 57.2,26.29 53.77,22.86 U2.18 53.64,17.91 53.64,17.53 50.34,14.22 50.34,11.3 40.44,11.3 U$1.5V | v59.61,31.75 65.33,31.75 65.33,32 C3.1 | U5.8 7.16,19.68 6.27,20.57 C5.1 6.14,20.83 3.35,23.62 3.1,40.89 | 92,76.71 92,75.56 U1.8 | 92,76.71 93.39,76.71 93.9,76.2 R9.1 | 79.17,62.74 80.19,63.75 R8.1 | 79.17,62.74 78.79,62.36 78.79,53.47 80.19,52.07 C1.1 80.06,51.94 78.79,50.67 78.79,44.58 v74.72,40.51 | 79.17,62.74 79.04,62.87 79.04,68.71 80.19,69.85 R3.1 80.44,69.98 80.44,70.36 82.34,72.26 82.34,76.71 92,76.71 | v72.95,39.37 65.71,32.13 C3.1 | 6.14,40.89 6.14,43.81 R12.2 | 26.46,30.1 26.59,30.1 28.62,32.13 28.62,37.21 16.56,37.21 12.88,40.89 6.14,40.89 | 3.1,40.89 6.14,40.89 | v34.59,10.41 31.8,10.41 31.8,13.21 26.21,18.8 C4.1
  Bottom 0.508: v58.09,31.75 v59.61,31.75 | v74.72,40.51 73.58,39.37 v72.95,39.37 | U$1.5V 36.75,10.41 v34.59,10.41
VOUT
  Top 0.508: U7.2 77.26,46.35 77.26,47.62 U7.3 77.01,47.75 72.69,47.75 72.57,47.88 | 72.57,47.88 72.57,54.1 73.07,54.61 R10.1 | 71.68,46.99 71.04,46.35 U7.7 | 71.68,46.99 72.57,47.88 | U7.6 71.04,47.62 71.68,46.99

### Text on the board
bNames: So then it's up with the Blue and Gold, Down with the Red... | Made in the PCR, Coast Division, NMRA | www. | SP Coast | .com | v2.4 | Go Bears! | Railroadshield | layout interface board | Model Railroading is fun! | Solder Side
Document: X | Y | Loconet | DCC | I/O | Loconet Termination | Made in the PCR, Coast Division, NMRA | Loconet | "Go Bears!" | A3 | A2 | A1 | A0 | D10 | D9 | D8 | D7 | D6 | D5 | D4 | D3 | D2 | D1 | D0 | BlueIO | GoldIO | xIO | yIO | /CS | /INT | RX | TX | RX | TX-EN | TX | RX | TX-EN | TX | RX | Loconet | Buttons/LEDs | CAN | DCC | Loconet | NCE | C/MRI | Loconet | XpressNet | CAN | RailroadShield | Rev. 2.5 | 2011.07 | Component Side | openLCB | CAN/openLCB | NCE | XPressNet | + IN- | +OUT- | Shield | + IN- | +OUT- | Shield | Ground | Open Source | CAN/openLCB | Reset | Hardware | seeed: 31126 | John Plocher | C/MRI
Reference: Fixed: Added Open Source Hardware Label